# Altium schematic sheet RF.SchDoc: RF
size 420 x 297 mm; SheetNumber: 4
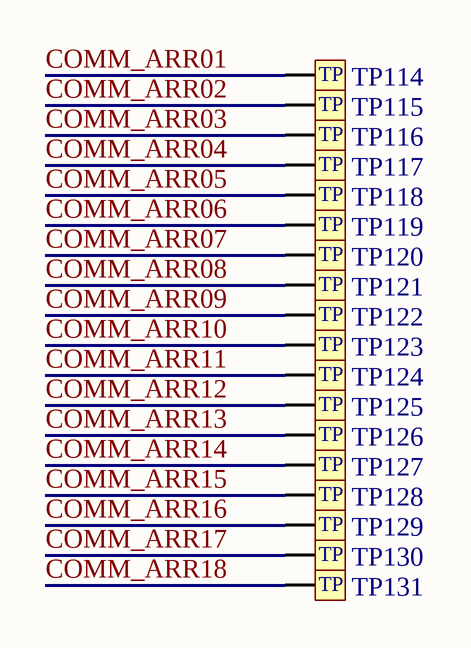
[diagram p0: RF.SchDoc]

## Parts
TP114  TP_0P8MM  [TP_0P8MM]  (value not drawn)  (no BOM)
TP115  TP_0P8MM  [TP_0P8MM]  (value not drawn)  (no BOM)
TP116  TP_0P8MM  [TP_0P8MM]  (value not drawn)  (no BOM)
TP117  TP_0P8MM  [TP_0P8MM]  (value not drawn)  (no BOM)
TP118  TP_0P8MM  [TP_0P8MM]  (value not drawn)  (no BOM)
TP119  TP_0P8MM  [TP_0P8MM]  (value not drawn)  (no BOM)
TP120  TP_0P8MM  [TP_0P8MM]  (value not drawn)  (no BOM)
TP121  TP_0P8MM  [TP_0P8MM]  (value not drawn)  (no BOM)
TP122  TP_0P8MM  [TP_0P8MM]  (value not drawn)  (no BOM)
TP123  TP_0P8MM  [TP_0P8MM]  (value not drawn)  (no BOM)
TP124  TP_0P8MM  [TP_0P8MM]  (value not drawn)  (no BOM)
TP125  TP_0P8MM  [TP_0P8MM]  (value not drawn)  (no BOM)
TP126  TP_0P8MM  [TP_0P8MM]  (value not drawn)  (no BOM)
TP127  TP_0P8MM  [TP_0P8MM]  (value not drawn)  (no BOM)
TP128  TP_0P8MM  [TP_0P8MM]  (value not drawn)  (no BOM)
TP129  TP_0P8MM  [TP_0P8MM]  (value not drawn)  (no BOM)
TP130  TP_0P8MM  [TP_0P8MM]  (value not drawn)  (no BOM)
TP131  TP_0P8MM  [TP_0P8MM]  (value not drawn)  (no BOM)

## Nets
COMM_ARR01: TP114.1
COMM_ARR02: TP115.1
COMM_ARR03: TP116.1
COMM_ARR04: TP117.1
COMM_ARR05: TP118.1
COMM_ARR06: TP119.1
COMM_ARR07: TP120.1
COMM_ARR08: TP121.1
COMM_ARR09: TP122.1
COMM_ARR10: TP123.1
COMM_ARR11: TP124.1
COMM_ARR12: TP125.1
COMM_ARR13: TP126.1
COMM_ARR14: TP127.1
COMM_ARR15: TP128.1
COMM_ARR16: TP129.1
COMM_ARR17: TP130.1
COMM_ARR18: TP131.1

## Notes on the sheet
- PROJECT
- SIZE
- FILE NAME
- A3
- TITLE
- SHEET
- OF
- REV
- (in symbol TP_0P8MM) TP

## Library data of the parts
TP114-TP131 = TP_0P8MM: OSM Footprint 0P8 LGA Ball